# EAGLE schematic MBEC8_DEBUG (EAGLE 5.10)
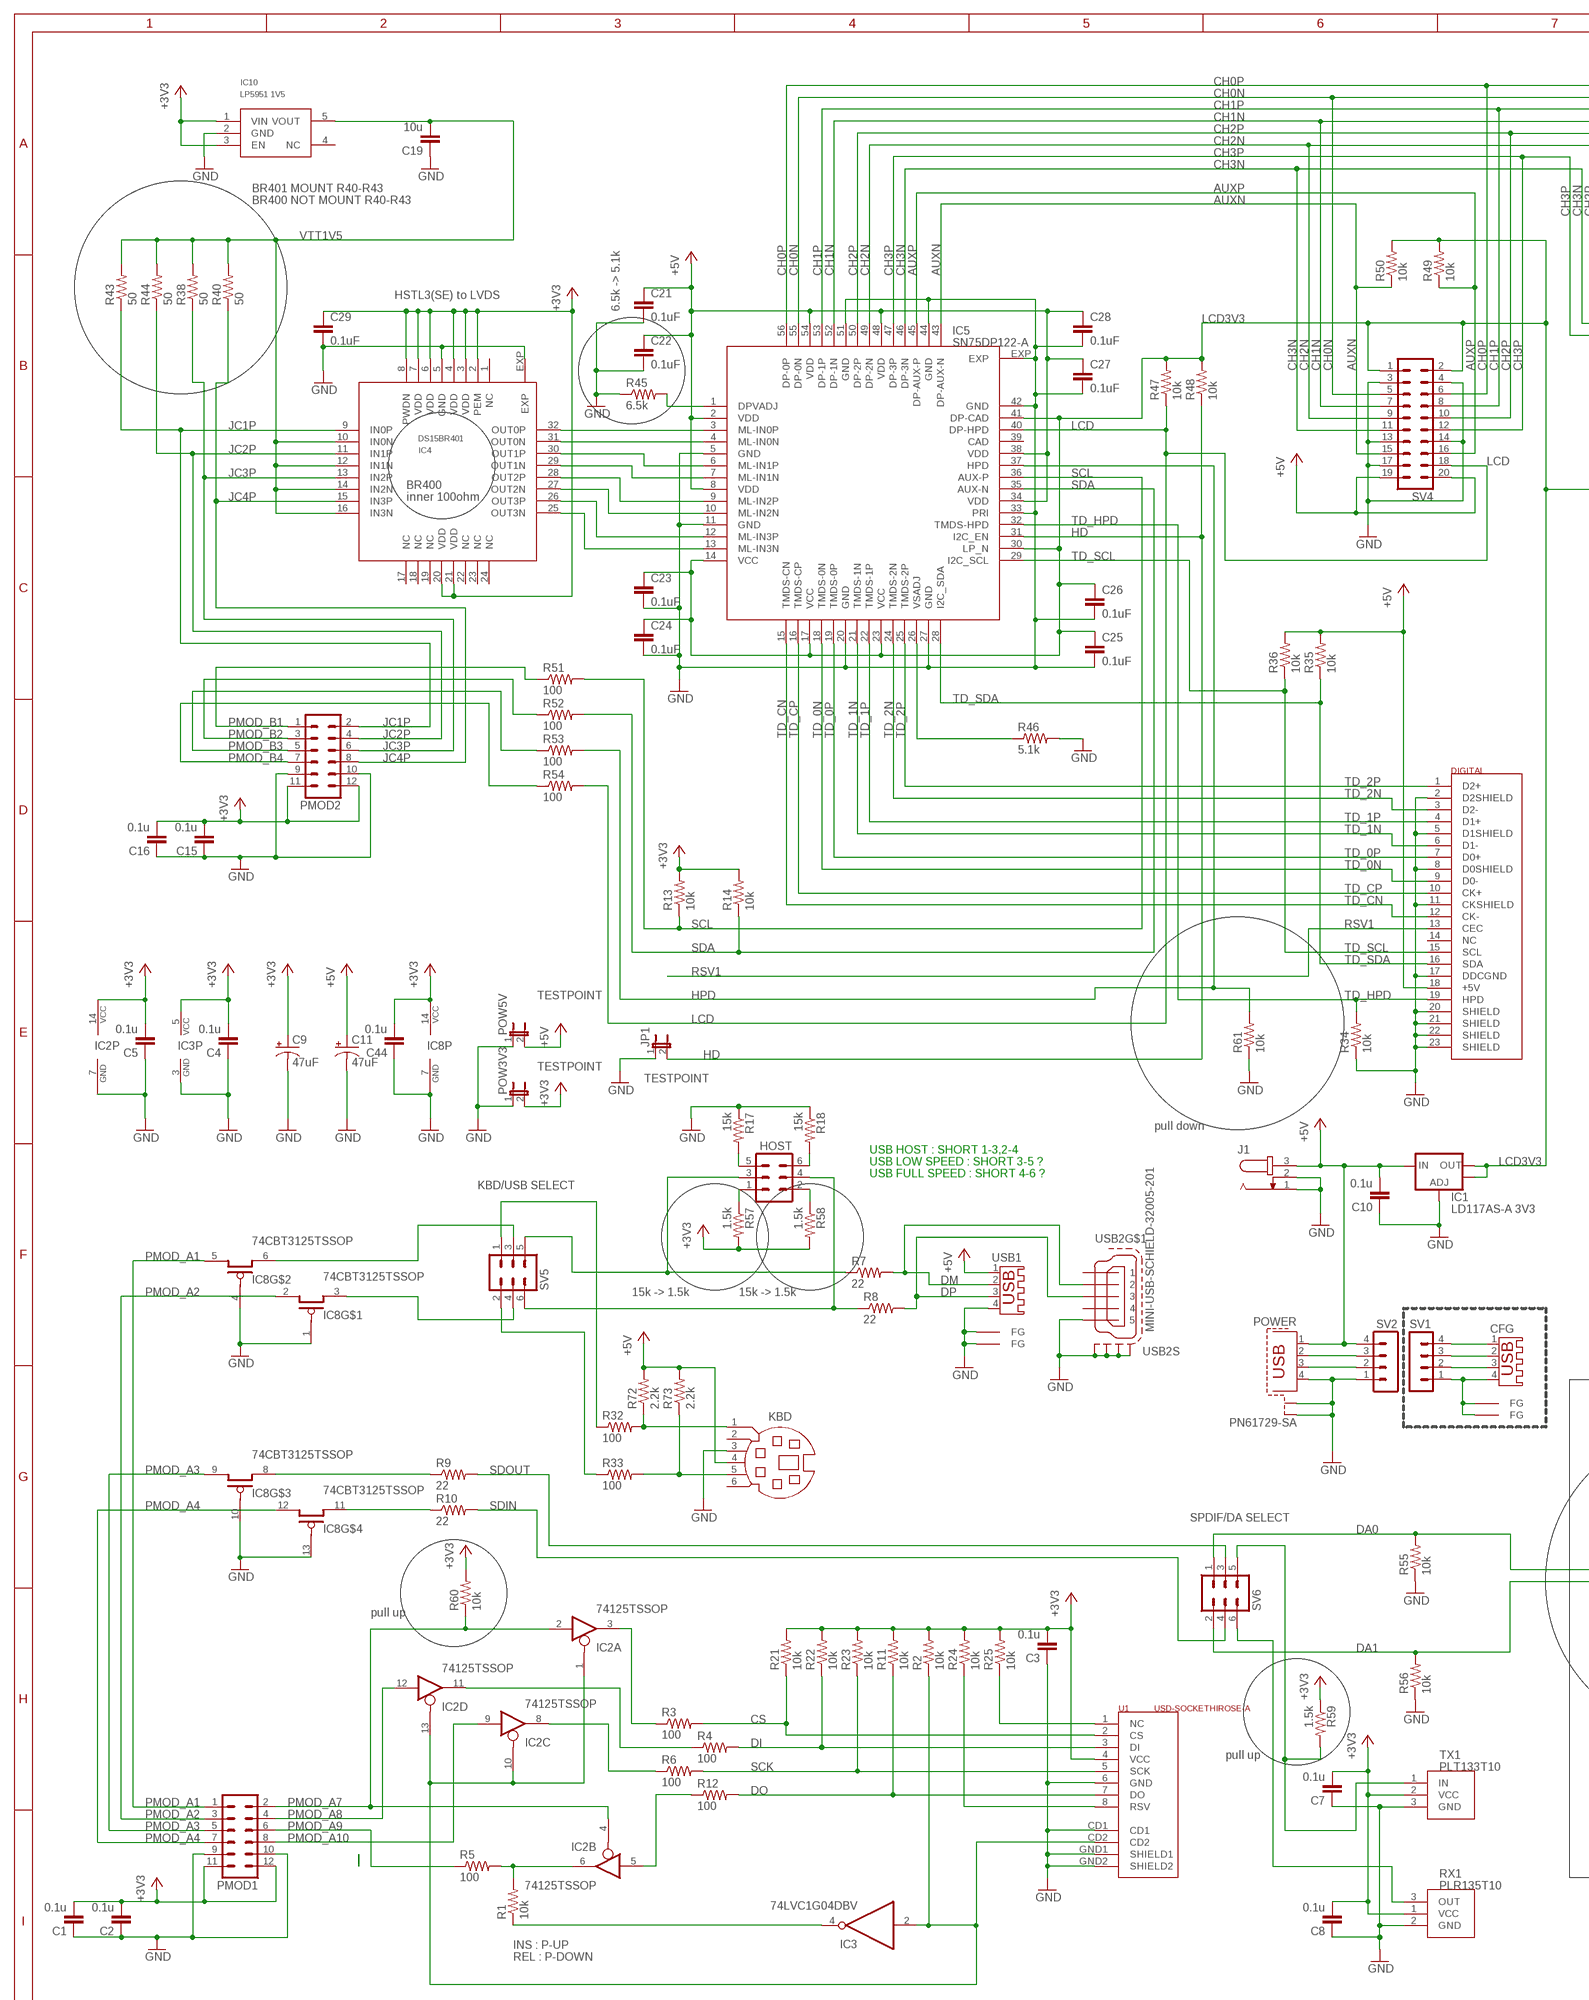
[diagram p0: schematic, sheet 1, part 1 of 2]
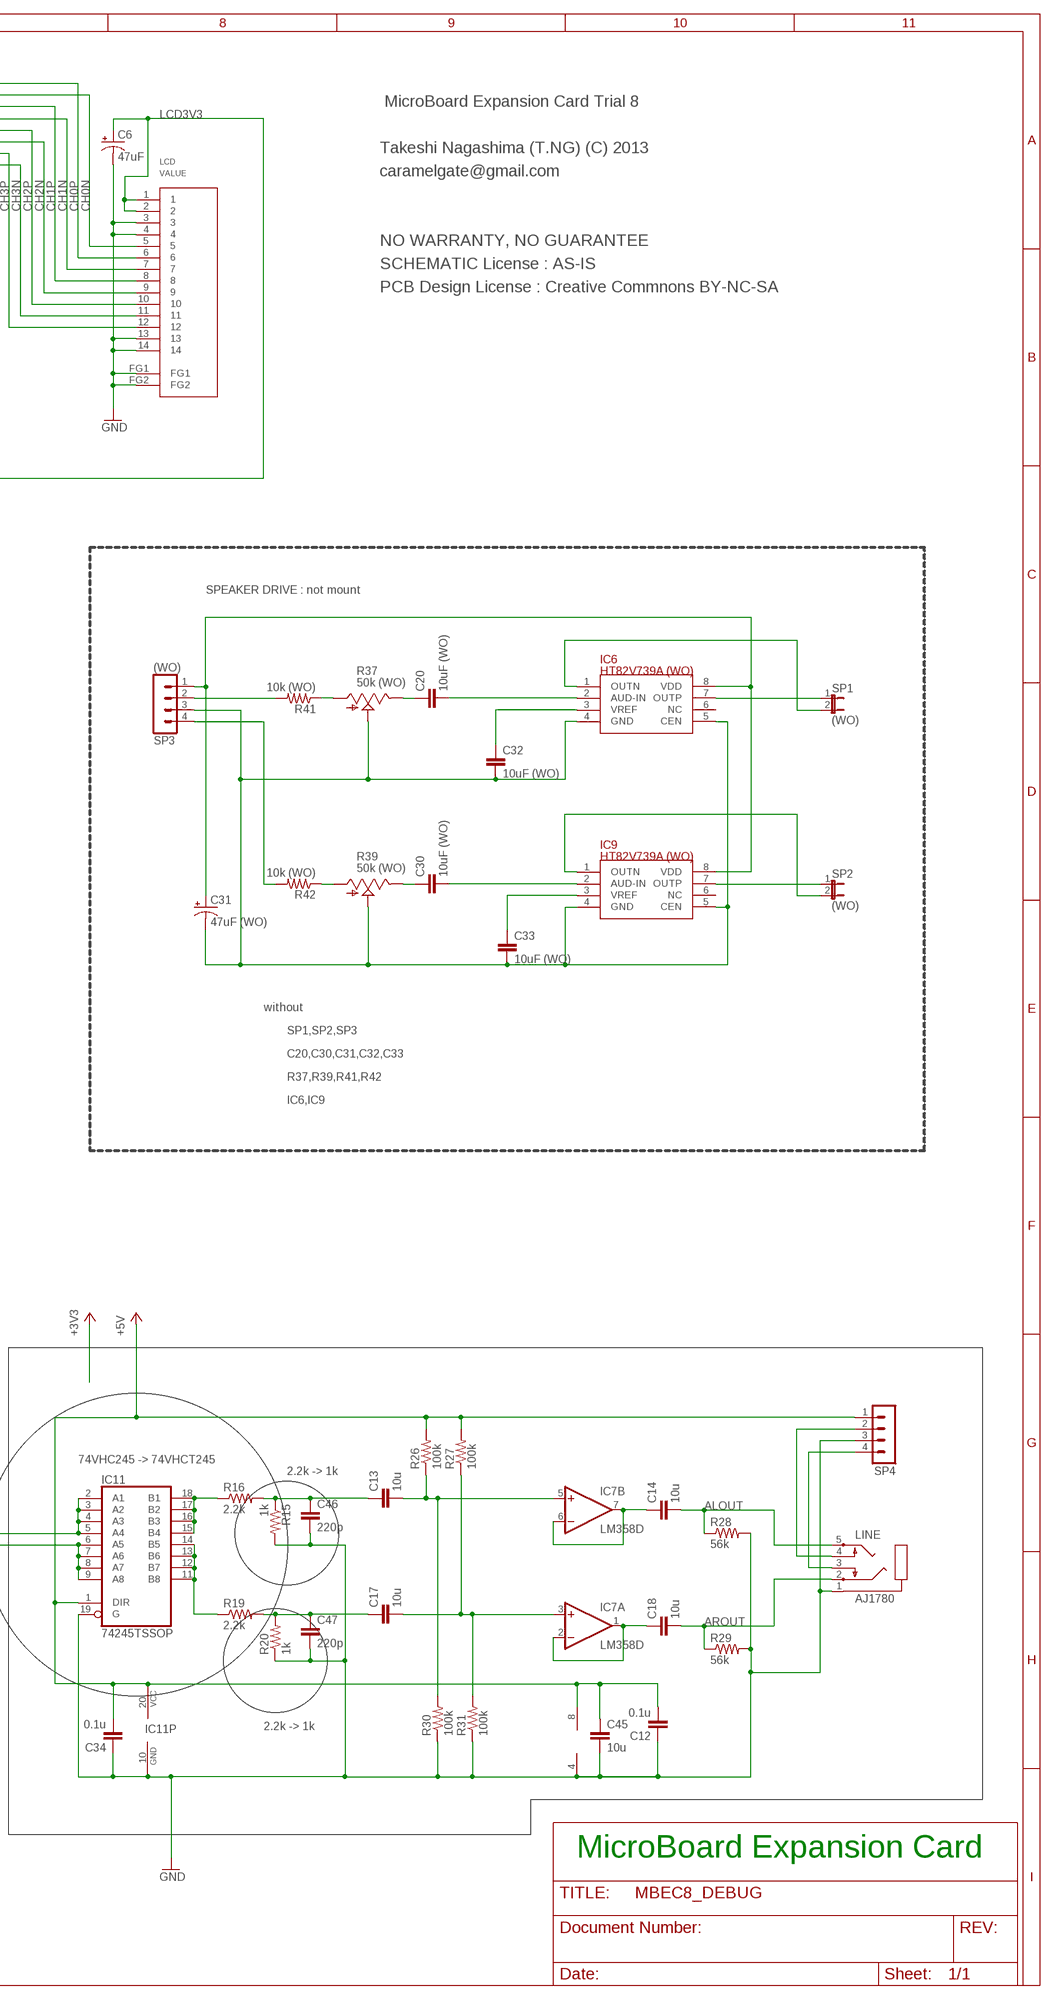
[diagram p1: schematic, sheet 1, part 2 of 2]

## Parts
C1  0.1u  C-EUC1608  [C1608]
C2  0.1u  C-EUC1608  [C1608]
C3  0.1u  C-EUC1608  [C1608]
C4  0.1u  C-EUC1608  [C1608]
C5  0.1u  C-EUC1608  [C1608]
C6  47uF  CPOL-USE2.5-7  [E2,5-7]
C7  0.1u  C-EUC1608  [C1608]
C8  0.1u  C-EUC1608  [C1608]
C9  47uF  CPOL-USE2.5-7  [E2,5-7]
C10  0.1u  C-EUC1608  [C1608]
C11  47uF  CPOL-USE2.5-7  [E2,5-7]
C12  0.1u  C-EUC1608  [C1608]
C13  10u  C-EUC2012  [C2012]
C14  10u  C-EUC2012  [C2012]
C15  0.1u  C-EUC1608  [C1608]
C16  0.1u  C-EUC1608  [C1608]
C17  10u  C-EUC2012  [C2012]
C18  10u  C-EUC2012  [C2012]
C19  10u  C-EUC2012  [C2012]
C20  10uF (WO)  C-EU025-025X050  [C025-025X050]
C21  0.1uF  C-EUC1608  [C1608]
C22  0.1uF  C-EUC1608  [C1608]
C23  0.1uF  C-EUC1608  [C1608]
C24  0.1uF  C-EUC1608  [C1608]
C25  0.1uF  C-EUC1608  [C1608]
C26  0.1uF  C-EUC1608  [C1608]
C27  0.1uF  C-EUC1608  [C1608]
C28  0.1uF  C-EUC1608  [C1608]
C29  0.1uF  C-EUC1608  [C1608]
C30  10uF (WO)  C-EU025-025X050  [C025-025X050]
C31  47uF (WO)  CPOL-USE2.5-7  [E2,5-7]
C32  10uF (WO)  C-EU025-025X050  [C025-025X050]
C33  10uF (WO)  C-EU025-025X050  [C025-025X050]
C34  0.1u  C-EUC1608  [C1608]
C44  0.1u  C-EUC1608  [C1608]
C45  10u  C-EUC2012  [C2012]
C46  220p  C-EUC1608  [C1608]
C47  220p  C-EUC1608  [C1608]
CFG  USB-A003A  [USB-A]
DIGITAL  HDMIHDMI-FCI-A  [HDMI-FCI-A-UPDATE]
HOST  MA03-2  [MA03-2]
IC1  LD117AS-A 3V3  LD117AS-A  [SOT223]
IC2  74125TSSOP  [PW_R-PDSO-G14]
IC3  74LVC1G04DBV  [SOT23-5]
IC4  DS15BR401  [QFN32A]
IC5  SN75DP122-A  [QFN56A]
IC6  HT82V739A (WO)  HT82V739A  [DIL8A]
IC7  LM358D  [SO08]
IC8  74CBT3125TSSOP  [PW_R-PDSO-G14]
IC9  HT82V739A (WO)  HT82V739A  [DIL8A]
IC10  LP5951 1V5  LP5951  [SOT23-5]
IC11  74245TSSOP  [PW_R-PDSO-G20]
J1  JACK-PLUG0A  [SPC4077A]
JP1  JP1EA  [JP1A]
KBD  MD06SS1  [MDIN06SSA]
LCD  DF19-14P  [DF19G-14P-1H]
LINE  AJ1780  PG203JA  [PG203JA]
PMOD1  MA06-2PMOD  [MA06-2P]
PMOD2  MA06-2PMOD  [MA06-2P]
POW3V3  JP1EA  [JP1A]
POW5V  JP1EA  [JP1A]
POWER  PN61729-SA  [PN61729-SA]
R1  10k  R-US_R0603  [R0603]
R2  10k  R-US_R0603  [R0603]
R3  100  R-US_R0603  [R0603]
R4  100  R-US_R0603  [R0603]
R5  100  R-US_R0603  [R0603]
R6  100  R-US_R0603  [R0603]
R7  22  R-US_R0603  [R0603]
R8  22  R-US_R0603  [R0603]
R9  22  R-US_R0603  [R0603]
R10  22  R-US_R0603  [R0603]
R11  10k  R-US_R0603  [R0603]
R12  100  R-US_R0603  [R0603]
R13  10k  R-US_R0603  [R0603]
R14  10k  R-US_R0603  [R0603]
R15  1k  R-US_R0603  [R0603]
R16  2.2k  R-US_R0603  [R0603]
R17  15k  R-US_R0603  [R0603]
R18  15k  R-US_R0603  [R0603]
R19  2.2k  R-US_R0603  [R0603]
R20  1k  R-US_R0603  [R0603]
R21  10k  R-US_R0603  [R0603]
R22  10k  R-US_R0603  [R0603]
R23  10k  R-US_R0603  [R0603]
R24  10k  R-US_R0603  [R0603]
R25  10k  R-US_R0603  [R0603]
R26  100k  R-US_R0603  [R0603]
R27  100k  R-US_R0603  [R0603]
R28  56k  R-US_R0603  [R0603]
R29  56k  R-US_R0603  [R0603]
R30  100k  R-US_R0603  [R0603]
R31  100k  R-US_R0603  [R0603]
R32  100  R-US_R0603  [R0603]
R33  100  R-US_R0603  [R0603]
R34  10k  R-US_R0603  [R0603]
R35  10k  R-US_R0603  [R0603]
R36  10k  R-US_R0603  [R0603]
R37  50k (WO)  TRIM_US-B25P  [B25P]
R38  50  R-US_R0603  [R0603]
R39  50k (WO)  TRIM_US-B25P  [B25P]
R40  50  R-US_R0603  [R0603]
R41  10k (WO)  R-US_0207/2V  [0207/2V]
R42  10k (WO)  R-US_0207/2V  [0207/2V]
R43  50  R-US_R0603  [R0603]
R44  50  R-US_R0603  [R0603]
R45  6.5k  R-US_R0603  [R0603]
R46  5.1k  R-US_R0603  [R0603]
R47  10k  R-US_R0603  [R0603]
R48  10k  R-US_R0603  [R0603]
R49  10k  R-US_R0603  [R0603]
R50  10k  R-US_R0603  [R0603]
R51  100  R-US_R0603  [R0603]
R52  100  R-US_R0603  [R0603]
R53  100  R-US_R0603  [R0603]
R54  100  R-US_R0603  [R0603]
R55  10k  R-US_R0603  [R0603]
R56  10k  R-US_R0603  [R0603]
R57  1.5k  R-US_R0603  [R0603]
R58  1.5k  R-US_R0603  [R0603]
R59  1.5k  R-US_R0603  [R0603]
R60  10k  R-US_R0603  [R0603]
R61  10k  R-US_R0603  [R0603]
R72  2.2k  R-US_R0603  [R0603]
R73  2.2k  R-US_R0603  [R0603]
RX1  PLR135T10  [PL_13X/T10]
SP1  (WO)  JP1EA  [JP1A]
SP2  (WO)  JP1EA  [JP1A]
SP3  (WO)  MA04-1A  [MA04-1A]
SP4  MA04-1A  [MA04-1A]
SV1  MA04-1A  [MA04-1A]
SV2  MA04-1A  [MA04-1A]
SV4  MA10-2S  [MA10-2S]
SV5  MA03-2  [MA03-2]
SV6  MA03-2  [MA03-2]
TX1  PLT133T10  [PL_13X/T10]
U1  USD-SOCKETHIROSE-A  [DM3A-SF-PEJ-A]
USB1  USB-A003A  [USB-A]
USB2  MINI-USB-SCHIELD-32005-201  [32005-201]

## Nets
+3V3: C1.2 C2.2 C3.2 C4.2 C5.2 C7.2 C8.2 C9.+ C15.2 C16.2 C29.1 C44.2 IC2.14(P:VCC) IC3.5(VCC) IC4.2(PEM) IC4.3(VDD) IC4.4(VDD) IC4.6(VDD) IC4.7(VDD) IC4.8(PWDN) IC4.20(VDD) IC4.21(VDD) IC8.14(P:VCC) IC10.1(VIN) IC10.3(EN) PMOD1.11 PMOD1.12 PMOD2.11 PMOD2.12 POW3V3.2 R2.2 R11.2 R13.2 R14.2 R21.2 R22.2 R23.2 R24.2 R25.2 R57.2 R58.2 R59.1 R60.2 RX1.1(VCC) TX1.2(VCC) U1.4(VCC)
+5V: C10.2 C11.+ C12.2 C21.1 C22.1 C27.1 C28.1 C34.2 C45.1 DIGITAL.18(+5V) IC1.3(IN) IC5.2(VDD) IC5.8(VDD) IC5.34(VDD) IC5.38(VDD) IC5.48(VDD) IC5.54(VDD) IC7.8(P:V+) IC11.1(DIR) IC11.20(VCC) J1.3 KBD.4 POW5V.2 POWER.1 R26.2 R27.2 R35.2 R36.2 R72.2 R73.2 SP4.1 SV2.4 SV4.19 SV4.20 USB1.1
ALOUT: C14.2 LINE.5 R28.1
AROUT: C18.2 LINE.2 R29.1
AUXN: IC5.43(DP-AUX-N) R50.1 SV4.15
AUXP: IC5.45(DP-AUX-P) R49.1 SV4.16
CH0N: IC5.55(DP-0N) LCD.5 SV4.5
CH0P: IC5.56(DP-0P) LCD.6 SV4.6
CH1N: IC5.52(DP-1N) LCD.7 SV4.7
CH1P: IC5.53(DP-1P) LCD.8 SV4.8
CH2N: IC5.49(DP-2N) LCD.9 SV4.9
CH2P: IC5.50(DP-2P) LCD.10 SV4.10
CH3N: IC5.46(DP-3N) LCD.11 SV4.11
CH3P: IC5.47(DP-3P) LCD.12 SV4.12
CS: R3.2 R21.1 U1.2(CS)
DA0: IC11.2(A1) IC11.3(A2) IC11.4(A3) IC11.5(A4) R55.2 SV6.1
DA1: IC11.6(A5) IC11.7(A6) IC11.8(A7) IC11.9(A8) R56.2 SV6.2
DI: R4.2 R22.1 U1.3(DI)
DM: R7.2 USB1.2 USB2.2
DO: R11.1 R12.2 U1.7(DO)
DP: R8.2 USB1.3 USB2.3
GND: C1.1 C2.1 C3.1 C4.1 C5.1 C6.- C7.1 C8.1 C9.- C10.1 C11.- C12.1 C15.1 C16.1 C19.1 C21.2 C22.2 C23.2 C24.2 C25.2 C26.2 C27.2 C28.2 C29.2 C34.1 C44.1 C45.2 C46.2 C47.2 DIGITAL.2(D2SHIELD) DIGITAL.5(D1SHIELD) DIGITAL.8(D0SHIELD) DIGITAL.11(CKSHIELD) DIGITAL.17(DDCGND) DIGITAL.20(SHIELD) DIGITAL.21(SHIELD) DIGITAL.22(SHIELD) DIGITAL.23(SHIELD) IC1.1(ADJ) IC2.7(P:GND) IC3.3(GND) IC4.5(GND) IC4.EXP IC5.5(GND) IC5.11(GND) IC5.20(GND) IC5.27(GND) IC5.33(PRI) IC5.42(GND) IC5.44(GND) IC5.51(GND) IC5.EXP IC7.4(P:V-) IC8.1(OE) IC8.4(OE) IC8.7(P:GND) IC8.10(OE) IC8.13(OE) IC10.2(GND) IC11.10(GND) IC11.19(G) J1.1 J1.2 JP1.1 KBD.3 LCD.3 LCD.4 LCD.13 LCD.14 LCD.FG1 LCD.FG2 LINE.1 PMOD1.9 PMOD1.10 PMOD2.9 PMOD2.10 POW3V3.1 POW5V.1 POWER.4 POWER.S1 POWER.S2 R15.2 R17.1 R18.1 R20.1 R28.2 R29.2 R30.1 R31.1 R34.1 R45.1 R46.2 R55.1 R56.1 R61.1 RX1.2(GND) SP4.3 SV2.1 SV4.3 SV4.4 SV4.13 SV4.14 SV4.17 TX1.3(GND) U1.6(GND) U1.CD1 U1.GND1(SHIELD1) U1.GND2(SHIELD2) USB1.4 USB1.P$1(FG) USB1.P$2(FG) USB2.5 USB2.M1(S:S1) USB2.M2(S:S2) USB2.M3(S:S3) USB2.M4(S:S4)
HD: IC5.31(I2C_EN) JP1.2 R48.1
HPD: IC5.37(HPD) R53.2 R61.2
JC1P: IC4.9(IN0P) PMOD2.2 R43.1
JC2P: IC4.11(IN1P) PMOD2.4 R44.1
JC3P: IC4.13(IN2P) PMOD2.6 R38.1
JC4P: IC4.15(IN3P) PMOD2.8 R40.1
LCD: IC5.40(DP-HPD) R47.1 R54.2 SV4.18
LCD3V3: C6.+ C23.1 C24.1 C25.1 C26.1 IC1.2(OUT) IC1.4(OUT) IC5.14(VCC) IC5.17(VCC) IC5.23(VCC) IC5.30(LP_N) IC5.41(DP-CAD) LCD.1 LCD.2 R47.2 R48.2 R49.2 R50.2 SV4.1 SV4.2
N$1: IC11.15(B4) IC11.16(B3) IC11.17(B2) IC11.18(B1) R16.1
N$2: IC2.6(B:O) R1.2 R5.2
N$3: IC2.1(A:OE) IC2.10(C:OE) IC2.13(D:OE) IC3.2(I) R2.1 U1.CD2
N$4: IC3.4(O) R1.1
N$5: IC2.5(B:I) R12.1
N$6: IC2.3(A:O) R3.1
N$7: IC2.11(D:O) R4.1
N$8: IC2.8(C:O) R6.1
N$9: CFG.4 CFG.P$1(FG) CFG.P$2(FG) SV1.1
N$10: CFG.3 SV1.2
N$11: CFG.2 SV1.3
N$14: R33.1 SV5.2
N$18: R32.1 SV5.1
N$19: IC8.3(O) SV5.4
N$20: CFG.1 SV1.4
N$21: C14.1 IC7.6(B:-IN) IC7.7(B:OUT)
N$22: IC8.6(O) SV5.3
N$23: C18.1 IC7.1(A:OUT) IC7.2(A:-IN)
N$24: HOST.5 R17.2
N$25: HOST.6 R18.2
N$26: R59.2 SV6.5 TX1.1(IN)
N$27: POWER.2 SV2.3
N$28: POWER.3 SV2.2
N$29: R25.1 U1.1(NC)
N$30: R24.1 U1.8(RSV)
N$31: RX1.3(OUT) SV6.6
N$32: KBD.1 R32.2 R72.1
N$33: IC11.11(B8) IC11.12(B7) IC11.13(B6) IC11.14(B5) R19.1
N$34: C31.+ IC6.8(VDD) IC9.8(VDD) SP3.1
N$35: KBD.5 R33.2 R73.1
N$36: C31.- C32.2 C33.2 IC6.4(GND) IC6.5(CEN) IC9.4(GND) IC9.5(CEN) R37.S R39.S SP3.3
N$38: IC9.7(OUTP) SP2.1
N$39: IC4.32(OUT0P) IC5.3(ML-IN0P)
N$40: IC4.31(OUT0N) IC5.4(ML-IN0N)
N$41: IC4.30(OUT1P) IC5.6(ML-IN1P)
N$42: IC4.29(OUT1N) IC5.7(ML-IN1N)
N$43: IC4.28(OUT2P) IC5.9(ML-IN2P)
N$44: IC4.27(OUT2N) IC5.10(ML-IN2N)
N$45: IC4.26(OUT3P) IC5.12(ML-IN3P)
N$46: IC4.25(OUT3N) IC5.13(ML-IN3N)
N$47: C33.1 IC9.3(VREF)
N$48: C30.2 IC9.2(AUD-IN)
N$49: C32.1 IC6.3(VREF)
N$50: C20.2 IC6.2(AUD-IN)
N$51: IC5.1(DPVADJ) R45.2
N$52: IC5.26(VSADJ) R46.1
N$53: IC6.7(OUTP) SP1.1
N$54: IC6.1(OUTN) SP1.2
N$55: IC9.1(OUTN) SP2.2
N$56: R41.2 SP3.2
N$57: C20.1 R37.E
N$58: C30.1 R39.E
N$59: R37.A R41.1
N$60: R39.A R42.1
N$61: HOST.3 R7.1 SV5.5
N$62: R42.2 SP3.4
N$67: C13.2 IC7.5(B:+IN) R26.1 R30.2
N$68: HOST.4 R8.1 SV5.6
N$69: IC8.8(O) R9.1
N$70: IC8.11(O) R10.1
N$71: HOST.1 R57.1
N$72: HOST.2 R58.1
N$74: C17.2 IC7.3(A:+IN) R27.1 R31.2
N$75: C17.1 C47.1 R19.2 R20.2
N$78: C13.1 C46.1 R15.1 R16.2
N$79: LINE.4 SP4.2
N$80: LINE.3 SP4.4
PMOD_A1: IC8.5(I) PMOD1.1
PMOD_A2: IC8.2(I) PMOD1.3
PMOD_A3: IC8.9(I) PMOD1.5
PMOD_A4: IC8.12(I) PMOD1.7
PMOD_A7: IC2.2(A:I) IC2.4(B:OE) PMOD1.2 R60.1
PMOD_A8: IC2.12(D:I) PMOD1.4
PMOD_A9: PMOD1.6 R5.1
PMOD_A10: IC2.9(C:I) PMOD1.8
PMOD_B1: PMOD2.1 R51.1
PMOD_B2: PMOD2.3 R52.1
PMOD_B3: PMOD2.5 R53.1
PMOD_B4: PMOD2.7 R54.1
RSV1: DIGITAL.13(CEC)
SCK: R6.2 R23.1 U1.5(SCK)
SCL: IC5.36(AUX-P) R13.1 R51.2
SDA: IC5.35(AUX-N) R14.1 R52.2
SDIN: R10.2 SV6.4
SDOUT: R9.2 SV6.3
TD_0N: DIGITAL.9(D0-) IC5.18(TMDS-0N)
TD_0P: DIGITAL.7(D0+) IC5.19(TMDS-0P)
TD_1N: DIGITAL.6(D1-) IC5.21(TMDS-1N)
TD_1P: DIGITAL.4(D1+) IC5.22(TMDS-1P)
TD_2N: DIGITAL.3(D2-) IC5.24(TMDS-2N)
TD_2P: DIGITAL.1(D2+) IC5.25(TMDS-2P)
TD_CN: DIGITAL.12(CK-) IC5.15(TMDS-CN)
TD_CP: DIGITAL.10(CK+) IC5.16(TMDS-CP)
TD_HPD: DIGITAL.19(HPD) IC5.32(TMDS-HPD) R34.2
TD_SCL: DIGITAL.15(SCL) IC5.29(I2C_SCL) R36.1
TD_SDA: DIGITAL.16(SDA) IC5.28(I2C_SDA) R35.1
VTT1V5: C19.2 IC4.10(IN0N) IC4.12(IN1N) IC4.14(IN2N) IC4.16(IN3N) IC10.5(VOUT) R38.2 R40.2 R43.2 R44.2
Unconnected: DIGITAL.14(NC) IC4.1(NC) IC4.17(NC) IC4.18(NC) IC4.19(NC) IC4.22(NC) IC4.23(NC) IC4.24(NC) IC5.39(CAD) IC6.6(NC) IC9.6(NC) IC10.4(NC) KBD.2 KBD.6 USB2.1 USB2.4

## Notes on the sheet
- MicroBoard Expansion Card Trial 8
- Takeshi Nagashima (T.NG) (C) 2013
- caramelgate@gmail.com
- BR401 MOUNT R40-R43
- BR400 NOT MOUNT R40-R43
- NO WARRANTY, NO GUARANTEE
- SCHEMATIC License : AS-IS
- HSTL3(SE) to LVDS | PCB Design License : Creative Commnons BY-NC-SA
- 6.5k -> 5.1k
- BR400
- inner 100ohm
- SPEAKER DRIVE : not mount
- TESTPOINT
- without
- SP1,SP2,SP3
- TESTPOINT
- TESTPOINT | C20,C30,C31,C32,C33
- R37,R39,R41,R42
- pull down | IC6,IC9
- USB HOST : SHORT 1-3,2-4
- USB LOW SPEED : SHORT 3-5 ?
- USB FULL SPEED : SHORT 4-6 ?
- KBD/USB SELECT
- 15k -> 1.5k | 15k -> 1.5k
- 74VHC245 -> 74VHCT245
- 2.2k -> 1k
- SPDIF/DA SELECT
- pull up
- pull up
- 2.2k -> 1k
- MicroBoard Expansion Card
- INS : P-UP
- REL : P-DOWN

## Library data of the parts
C1-C5 C7 C8 C10 C12-C30 C32-C34 C44 C45 = add_lib:C-EU: CAPACITOR, European symbol
C6 C9 C11 C31 = rcl:CPOL-US: POLARIZED CAPACITOR, American symbol
C46 C47 = adcr:C-EU: CAPACITOR, European symbol
CFG USB1 = add_lib:USB-A003: USB connector
DIGITAL = adcr:HDMI
HOST SV5 SV6 = add_lib:MA03-2: PIN HEADER
IC1 = add_lib:LD117A?*-A
IC2 = add_lib:74*125: Quad bus BUFFER, 3-state
IC3 = 74xx-little-us:74*1G04: INVERTER Gate
IC4 = add_lib:DS15BR401
IC5 = add_lib:SN75DP122
IC6 IC9 = add_lib:HT82V739
IC7 = add_lib:LM358: OP AMP also LM158; LM258; LM2904 Source: http://cache.national.com/ds/LM/LM158.pdf
IC8 = add_lib:74CBT3125
IC10 = add_lib:LP5951
IC11 = add_lib:74*245: Octal BUS TRANSCEIVER, 3-state
J1 = add_lib:JACK-PLUG: DC POWER JACK Power Jack, DC, Right Angle, Through Hole, Rated 5A at 16VDC, PC Terminals Distributor: Farnell (www.Farnell.de) Drawing: 84N1161.pdf / 84N1162.pdf Manufacturer: SPC Technology (www.spctechnology.com) Type: SPC4077 / SPC 4078
JP1 POW3V3 POW5V SP1 SP2 = add_lib:JP1E: JUMPER
KBD = add_lib:MD06SS: YAMAICHI CONNECTOR
LCD = add_lib:DF19-14P
LINE = add_lib:PG203J: MIC/HEADPHONE JACK KS-S stereo microphone/headphone jack PG203JN (Schukat)
PMOD1 PMOD2 = add_lib:MA06-2: PIN HEADER
POWER = add_lib:PN61729-S: BERG USB connector
R1-R12 R17 R18 R21-R25 R32 R33 R41 R42 R51-R54 R57-R60 = add_lib:R-US_: RESISTOR, American symbol
R13-R16 R19 R20 R26-R31 R34-R36 R38 R40 R43-R50 R55 R56 R61 R72 R73 = adcr:R-US_: RESISTOR, American symbol
R37 R39 = adcr:TRIM_US-: POTENTIOMETER
RX1 = add_lib:PLR135
SP3 SP4 SV1 SV2 = add_lib:MA04-1: PIN HEADER
SV4 = add_lib:MA10-2: PIN HEADER
TX1 = add_lib:PLT133
U1 = add_lib:USD-SOCKET: microSD Socket Push-push type uSD socket. Schematic element and footprint production proven. Spark Fun Electronics SKU : PRT-00127. tDoc lines correctly indicate media card edge positions when inserting (unlocked, locked, depressed).
USB2 = add_lib:MINI-USB-SCHIELD-: MINI USB-B Conector Source: www.cypressindustries.com